# EAGLE schematic 12ChannelEMG (EAGLE 6.3)
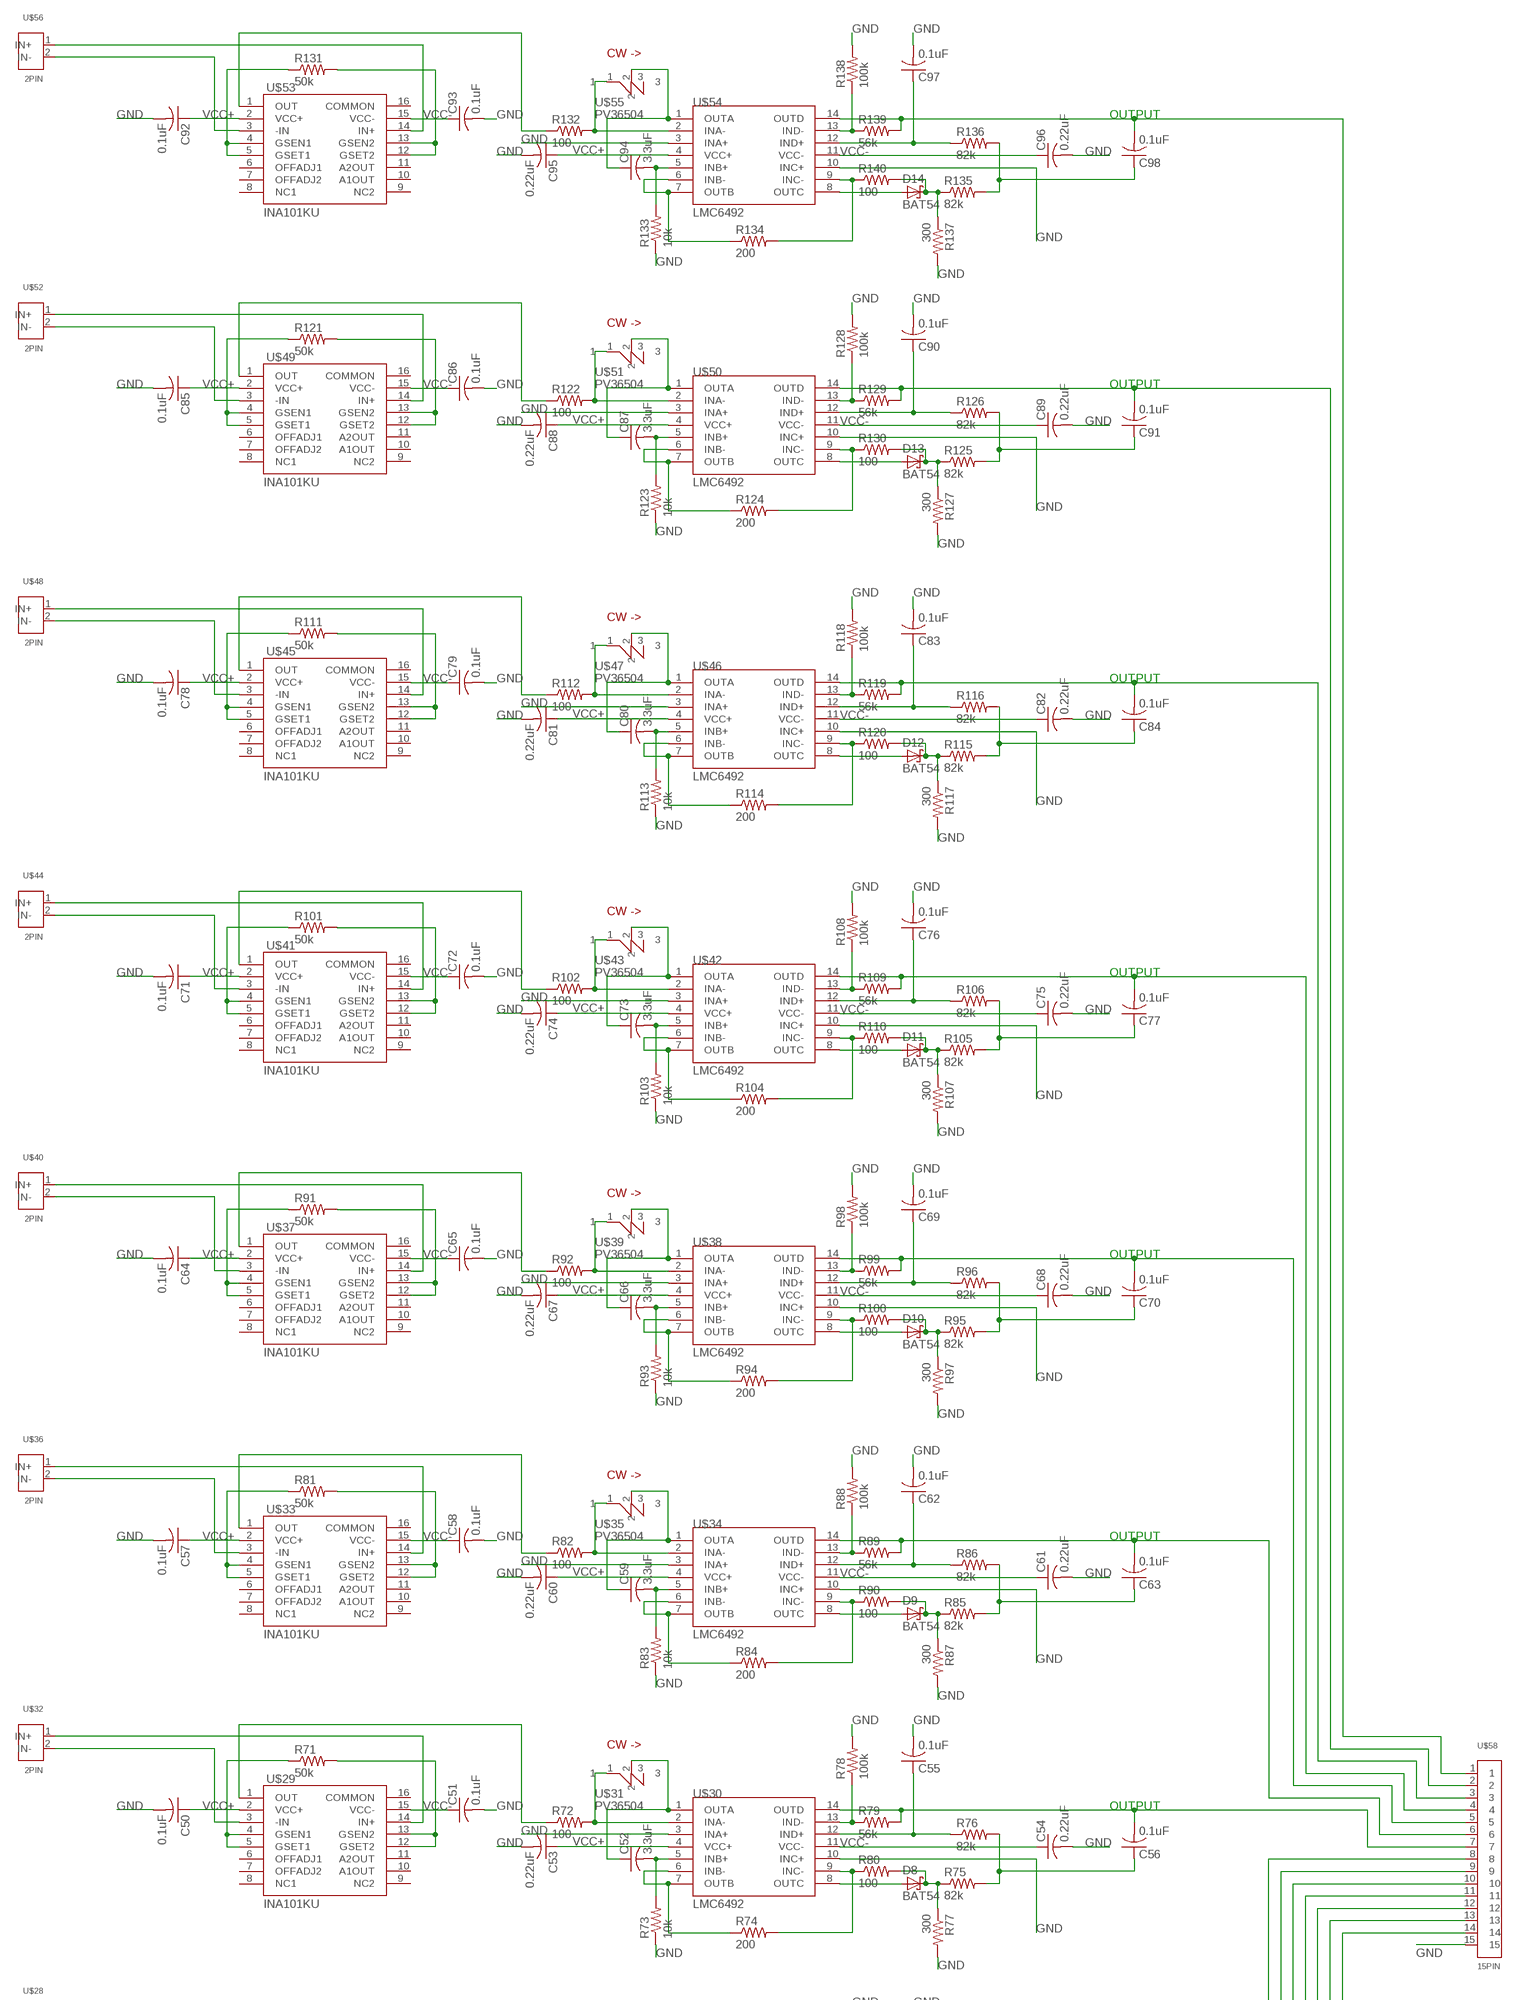
[diagram p0: schematic, sheet 1, part 1 of 2]
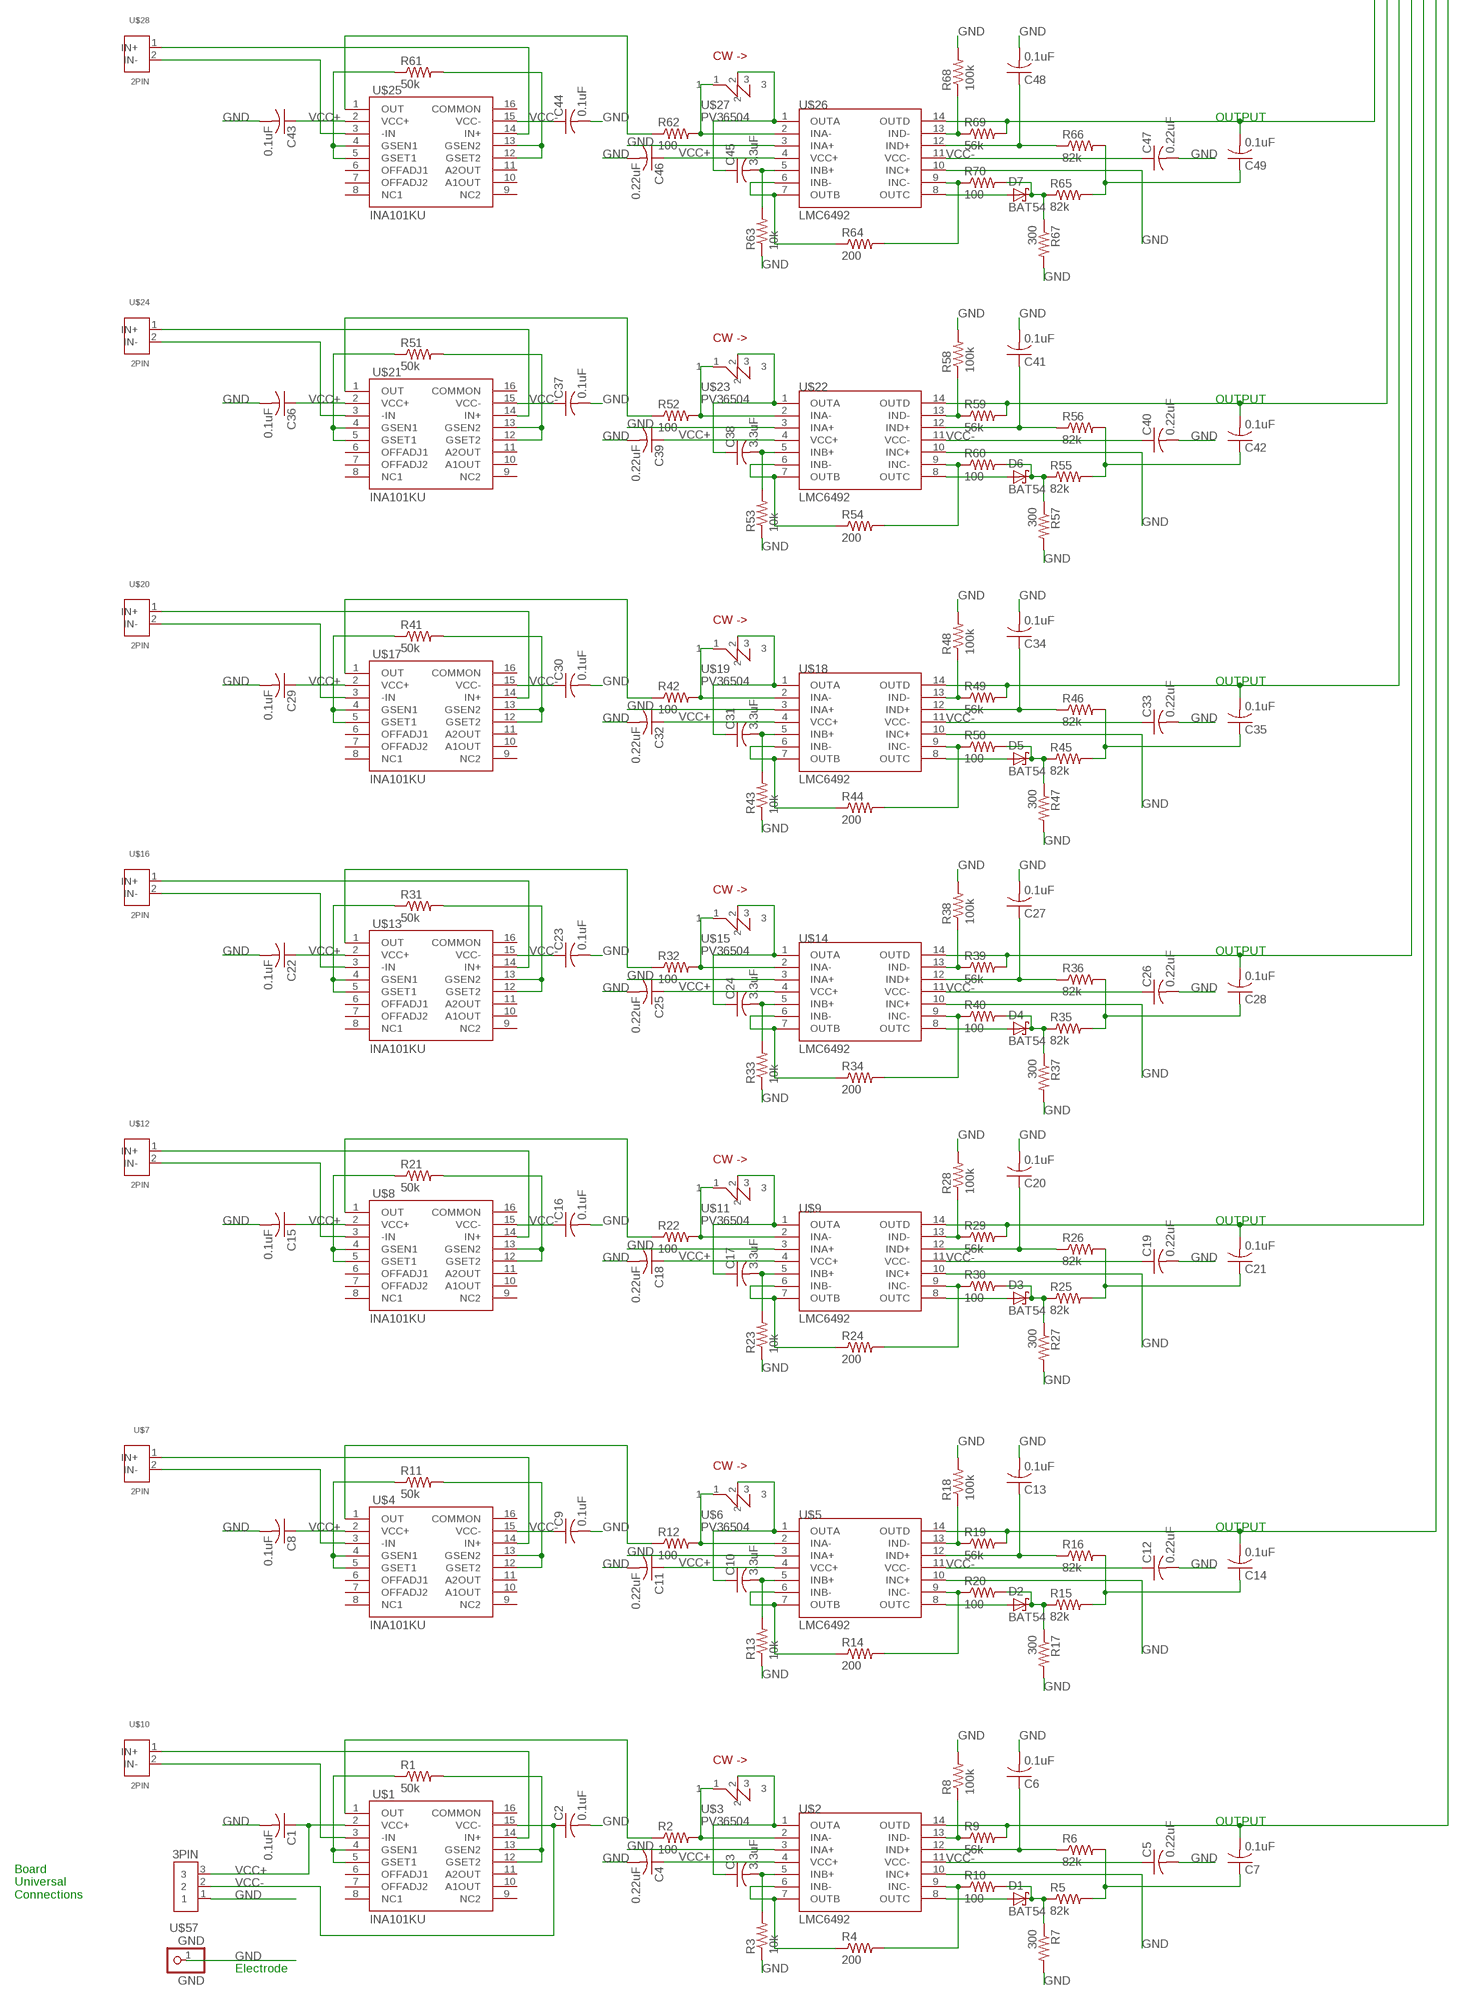
[diagram p1: schematic, sheet 1, part 2 of 2]

## Parts
C1  0.1uF  C-USC1206K  [C1206K]
C2  0.1uF  C-USC1206K  [C1206K]
C3  3.3uF  C-USC1206K  [C1206K]
C4  0.22uF  C-USC0603K  [C0603K]
C5  0.22uF  C-USC0603K  [C0603K]
C6  0.1uF  C-USC1206K  [C1206K]
C7  0.1uF  C-USC1206K  [C1206K]
C8  0.1uF  C-USC1206K  [C1206K]
C9  0.1uF  C-USC1206K  [C1206K]
C10  3.3uF  C-USC1206K  [C1206K]
C11  0.22uF  C-USC0603K  [C0603K]
C12  0.22uF  C-USC0603K  [C0603K]
C13  0.1uF  C-USC1206K  [C1206K]
C14  0.1uF  C-USC1206K  [C1206K]
C15  0.1uF  C-USC1206K  [C1206K]
C16  0.1uF  C-USC1206K  [C1206K]
C17  3.3uF  C-USC1206K  [C1206K]
C18  0.22uF  C-USC0603K  [C0603K]
C19  0.22uF  C-USC0603K  [C0603K]
C20  0.1uF  C-USC1206K  [C1206K]
C21  0.1uF  C-USC1206K  [C1206K]
C22  0.1uF  C-USC1206K  [C1206K]
C23  0.1uF  C-USC1206K  [C1206K]
C24  3.3uF  C-USC1206K  [C1206K]
C25  0.22uF  C-USC0603K  [C0603K]
C26  0.22uF  C-USC0603K  [C0603K]
C27  0.1uF  C-USC1206K  [C1206K]
C28  0.1uF  C-USC1206K  [C1206K]
C29  0.1uF  C-USC1206K  [C1206K]
C30  0.1uF  C-USC1206K  [C1206K]
C31  3.3uF  C-USC1206K  [C1206K]
C32  0.22uF  C-USC0603K  [C0603K]
C33  0.22uF  C-USC0603K  [C0603K]
C34  0.1uF  C-USC1206K  [C1206K]
C35  0.1uF  C-USC1206K  [C1206K]
C36  0.1uF  C-USC1206K  [C1206K]
C37  0.1uF  C-USC1206K  [C1206K]
C38  3.3uF  C-USC1206K  [C1206K]
C39  0.22uF  C-USC0603K  [C0603K]
C40  0.22uF  C-USC0603K  [C0603K]
C41  0.1uF  C-USC1206K  [C1206K]
C42  0.1uF  C-USC1206K  [C1206K]
C43  0.1uF  C-USC1206K  [C1206K]
C44  0.1uF  C-USC1206K  [C1206K]
C45  3.3uF  C-USC1206K  [C1206K]
C46  0.22uF  C-USC0603K  [C0603K]
C47  0.22uF  C-USC0603K  [C0603K]
C48  0.1uF  C-USC1206K  [C1206K]
C49  0.1uF  C-USC1206K  [C1206K]
C50  0.1uF  C-USC1206K  [C1206K]
C51  0.1uF  C-USC1206K  [C1206K]
C52  3.3uF  C-USC1206K  [C1206K]
C53  0.22uF  C-USC0603K  [C0603K]
C54  0.22uF  C-USC0603K  [C0603K]
C55  0.1uF  C-USC1206K  [C1206K]
C56  0.1uF  C-USC1206K  [C1206K]
C57  0.1uF  C-USC1206K  [C1206K]
C58  0.1uF  C-USC1206K  [C1206K]
C59  3.3uF  C-USC1206K  [C1206K]
C60  0.22uF  C-USC0603K  [C0603K]
C61  0.22uF  C-USC0603K  [C0603K]
C62  0.1uF  C-USC1206K  [C1206K]
C63  0.1uF  C-USC1206K  [C1206K]
C64  0.1uF  C-USC1206K  [C1206K]
C65  0.1uF  C-USC1206K  [C1206K]
C66  3.3uF  C-USC1206K  [C1206K]
C67  0.22uF  C-USC0603K  [C0603K]
C68  0.22uF  C-USC0603K  [C0603K]
C69  0.1uF  C-USC1206K  [C1206K]
C70  0.1uF  C-USC1206K  [C1206K]
C71  0.1uF  C-USC1206K  [C1206K]
C72  0.1uF  C-USC1206K  [C1206K]
C73  3.3uF  C-USC1206K  [C1206K]
C74  0.22uF  C-USC0603K  [C0603K]
C75  0.22uF  C-USC0603K  [C0603K]
C76  0.1uF  C-USC1206K  [C1206K]
C77  0.1uF  C-USC1206K  [C1206K]
C78  0.1uF  C-USC1206K  [C1206K]
C79  0.1uF  C-USC1206K  [C1206K]
C80  3.3uF  C-USC1206K  [C1206K]
C81  0.22uF  C-USC0603K  [C0603K]
C82  0.22uF  C-USC0603K  [C0603K]
C83  0.1uF  C-USC1206K  [C1206K]
C84  0.1uF  C-USC1206K  [C1206K]
C85  0.1uF  C-USC1206K  [C1206K]
C86  0.1uF  C-USC1206K  [C1206K]
C87  3.3uF  C-USC1206K  [C1206K]
C88  0.22uF  C-USC0603K  [C0603K]
C89  0.22uF  C-USC0603K  [C0603K]
C90  0.1uF  C-USC1206K  [C1206K]
C91  0.1uF  C-USC1206K  [C1206K]
C92  0.1uF  C-USC1206K  [C1206K]
C93  0.1uF  C-USC1206K  [C1206K]
C94  3.3uF  C-USC1206K  [C1206K]
C95  0.22uF  C-USC0603K  [C0603K]
C96  0.22uF  C-USC0603K  [C0603K]
C97  0.1uF  C-USC1206K  [C1206K]
C98  0.1uF  C-USC1206K  [C1206K]
D1  BAT54  [SOT23]
D2  BAT54  [SOT23]
D3  BAT54  [SOT23]
D4  BAT54  [SOT23]
D5  BAT54  [SOT23]
D6  BAT54  [SOT23]
D7  BAT54  [SOT23]
D8  BAT54  [SOT23]
D9  BAT54  [SOT23]
D10  BAT54  [SOT23]
D11  BAT54  [SOT23]
D12  BAT54  [SOT23]
D13  BAT54  [SOT23]
D14  BAT54  [SOT23]
GND  GND  PINHD-1X1  [1X01]
R1  50k  R-US_R0805  [R0805]
R2  100  R-US_R0603  [R0603]
R3  10k  R-US_R0603  [R0603]
R4  200  R-US_R0603  [R0603]
R5  82k  R-US_R0603  [R0603]
R6  82k  R-US_R0603  [R0603]
R7  300  R-US_R0603  [R0603]
R8  100k  R-US_R0603  [R0603]
R9  56k  R-US_R0603  [R0603]
R10  100  R-US_R0603  [R0603]
R11  50k  R-US_R0805  [R0805]
R12  100  R-US_R0603  [R0603]
R13  10k  R-US_R0603  [R0603]
R14  200  R-US_R0603  [R0603]
R15  82k  R-US_R0603  [R0603]
R16  82k  R-US_R0603  [R0603]
R17  300  R-US_R0603  [R0603]
R18  100k  R-US_R0603  [R0603]
R19  56k  R-US_R0603  [R0603]
R20  100  R-US_R0603  [R0603]
R21  50k  R-US_R0805  [R0805]
R22  100  R-US_R0603  [R0603]
R23  10k  R-US_R0603  [R0603]
R24  200  R-US_R0603  [R0603]
R25  82k  R-US_R0603  [R0603]
R26  82k  R-US_R0603  [R0603]
R27  300  R-US_R0603  [R0603]
R28  100k  R-US_R0603  [R0603]
R29  56k  R-US_R0603  [R0603]
R30  100  R-US_R0603  [R0603]
R31  50k  R-US_R0805  [R0805]
R32  100  R-US_R0603  [R0603]
R33  10k  R-US_R0603  [R0603]
R34  200  R-US_R0603  [R0603]
R35  82k  R-US_R0603  [R0603]
R36  82k  R-US_R0603  [R0603]
R37  300  R-US_R0603  [R0603]
R38  100k  R-US_R0603  [R0603]
R39  56k  R-US_R0603  [R0603]
R40  100  R-US_R0603  [R0603]
R41  50k  R-US_R0805  [R0805]
R42  100  R-US_R0603  [R0603]
R43  10k  R-US_R0603  [R0603]
R44  200  R-US_R0603  [R0603]
R45  82k  R-US_R0603  [R0603]
R46  82k  R-US_R0603  [R0603]
R47  300  R-US_R0603  [R0603]
R48  100k  R-US_R0603  [R0603]
R49  56k  R-US_R0603  [R0603]
R50  100  R-US_R0603  [R0603]
R51  50k  R-US_R0805  [R0805]
R52  100  R-US_R0603  [R0603]
R53  10k  R-US_R0603  [R0603]
R54  200  R-US_R0603  [R0603]
R55  82k  R-US_R0603  [R0603]
R56  82k  R-US_R0603  [R0603]
R57  300  R-US_R0603  [R0603]
R58  100k  R-US_R0603  [R0603]
R59  56k  R-US_R0603  [R0603]
R60  100  R-US_R0603  [R0603]
R61  50k  R-US_R0805  [R0805]
R62  100  R-US_R0603  [R0603]
R63  10k  R-US_R0603  [R0603]
R64  200  R-US_R0603  [R0603]
R65  82k  R-US_R0603  [R0603]
R66  82k  R-US_R0603  [R0603]
R67  300  R-US_R0603  [R0603]
R68  100k  R-US_R0603  [R0603]
R69  56k  R-US_R0603  [R0603]
R70  100  R-US_R0603  [R0603]
R71  50k  R-US_R0805  [R0805]
R72  100  R-US_R0603  [R0603]
R73  10k  R-US_R0603  [R0603]
R74  200  R-US_R0603  [R0603]
R75  82k  R-US_R0603  [R0603]
R76  82k  R-US_R0603  [R0603]
R77  300  R-US_R0603  [R0603]
R78  100k  R-US_R0603  [R0603]
R79  56k  R-US_R0603  [R0603]
R80  100  R-US_R0603  [R0603]
R81  50k  R-US_R0805  [R0805]
R82  100  R-US_R0603  [R0603]
R83  10k  R-US_R0603  [R0603]
R84  200  R-US_R0603  [R0603]
R85  82k  R-US_R0603  [R0603]
R86  82k  R-US_R0603  [R0603]
R87  300  R-US_R0603  [R0603]
R88  100k  R-US_R0603  [R0603]
R89  56k  R-US_R0603  [R0603]
R90  100  R-US_R0603  [R0603]
R91  50k  R-US_R0805  [R0805]
R92  100  R-US_R0603  [R0603]
R93  10k  R-US_R0603  [R0603]
R94  200  R-US_R0603  [R0603]
R95  82k  R-US_R0603  [R0603]
R96  82k  R-US_R0603  [R0603]
R97  300  R-US_R0603  [R0603]
R98  100k  R-US_R0603  [R0603]
R99  56k  R-US_R0603  [R0603]
R100  100  R-US_R0603  [R0603]
R101  50k  R-US_R0805  [R0805]
R102  100  R-US_R0603  [R0603]
R103  10k  R-US_R0603  [R0603]
R104  200  R-US_R0603  [R0603]
R105  82k  R-US_R0603  [R0603]
R106  82k  R-US_R0603  [R0603]
R107  300  R-US_R0603  [R0603]
R108  100k  R-US_R0603  [R0603]
R109  56k  R-US_R0603  [R0603]
R110  100  R-US_R0603  [R0603]
R111  50k  R-US_R0805  [R0805]
R112  100  R-US_R0603  [R0603]
R113  10k  R-US_R0603  [R0603]
R114  200  R-US_R0603  [R0603]
R115  82k  R-US_R0603  [R0603]
R116  82k  R-US_R0603  [R0603]
R117  300  R-US_R0603  [R0603]
R118  100k  R-US_R0603  [R0603]
R119  56k  R-US_R0603  [R0603]
R120  100  R-US_R0603  [R0603]
R121  50k  R-US_R0805  [R0805]
R122  100  R-US_R0603  [R0603]
R123  10k  R-US_R0603  [R0603]
R124  200  R-US_R0603  [R0603]
R125  82k  R-US_R0603  [R0603]
R126  82k  R-US_R0603  [R0603]
R127  300  R-US_R0603  [R0603]
R128  100k  R-US_R0603  [R0603]
R129  56k  R-US_R0603  [R0603]
R130  100  R-US_R0603  [R0603]
R131  50k  R-US_R0805  [R0805]
R132  100  R-US_R0603  [R0603]
R133  10k  R-US_R0603  [R0603]
R134  200  R-US_R0603  [R0603]
R135  82k  R-US_R0603  [R0603]
R136  82k  R-US_R0603  [R0603]
R137  300  R-US_R0603  [R0603]
R138  100k  R-US_R0603  [R0603]
R139  56k  R-US_R0603  [R0603]
R140  100  R-US_R0603  [R0603]
U$1  INA101KU  INA101KUINA101KU  [SOIC167.5MM]
U$2  LMC6492  [SOIC14]
U$3  PV36504  PV36  [PV36W]
U$4  INA101KU  INA101KUINA101KU  [SOIC167.5MM]
U$5  LMC6492  [SOIC14]
U$6  PV36504  PV36  [PV36W]
U$7  2PIN  [2PIN]
U$8  INA101KU  INA101KUINA101KU  [SOIC167.5MM]
U$9  LMC6492  [SOIC14]
U$10  2PIN  [2PIN]
U$11  PV36504  PV36  [PV36W]
U$12  2PIN  [2PIN]
U$13  INA101KU  INA101KUINA101KU  [SOIC167.5MM]
U$14  LMC6492  [SOIC14]
U$15  PV36504  PV36  [PV36W]
U$16  2PIN  [2PIN]
U$17  INA101KU  INA101KUINA101KU  [SOIC167.5MM]
U$18  LMC6492  [SOIC14]
U$19  PV36504  PV36  [PV36W]
U$20  2PIN  [2PIN]
U$21  INA101KU  INA101KUINA101KU  [SOIC167.5MM]
U$22  LMC6492  [SOIC14]
U$23  PV36504  PV36  [PV36W]
U$24  2PIN  [2PIN]
U$25  INA101KU  INA101KUINA101KU  [SOIC167.5MM]
U$26  LMC6492  [SOIC14]
U$27  PV36504  PV36  [PV36W]
U$28  2PIN  [2PIN]
U$29  INA101KU  INA101KUINA101KU  [SOIC167.5MM]
U$30  LMC6492  [SOIC14]
U$31  PV36504  PV36  [PV36W]
U$32  2PIN  [2PIN]
U$33  INA101KU  INA101KUINA101KU  [SOIC167.5MM]
U$34  LMC6492  [SOIC14]
U$35  PV36504  PV36  [PV36W]
U$36  2PIN  [2PIN]
U$37  INA101KU  INA101KUINA101KU  [SOIC167.5MM]
U$38  LMC6492  [SOIC14]
U$39  PV36504  PV36  [PV36W]
U$40  2PIN  [2PIN]
U$41  INA101KU  INA101KUINA101KU  [SOIC167.5MM]
U$42  LMC6492  [SOIC14]
U$43  PV36504  PV36  [PV36W]
U$44  2PIN  [2PIN]
U$45  INA101KU  INA101KUINA101KU  [SOIC167.5MM]
U$46  LMC6492  [SOIC14]
U$47  PV36504  PV36  [PV36W]
U$48  2PIN  [2PIN]
U$49  INA101KU  INA101KUINA101KU  [SOIC167.5MM]
U$50  LMC6492  [SOIC14]
U$51  PV36504  PV36  [PV36W]
U$52  2PIN  [2PIN]
U$53  INA101KU  INA101KUINA101KU  [SOIC167.5MM]
U$54  LMC6492  [SOIC14]
U$55  PV36504  PV36  [PV36W]
U$56  2PIN  [2PIN]
U$57  3PIN  [3PIN]
U$58  15PIN  [15PIN]

## Nets
GND: C1.2 C2.2 C4.2 C5.2 C6.2 C8.2 C9.2 C11.2 C12.2 C13.2 C15.2 C16.2 C18.2 C19.2 C20.2 C22.2 C23.2 C25.2 C26.2 C27.2 C29.2 C30.2 C32.2 C33.2 C34.2 C36.2 C37.2 C39.2 C40.2 C41.2 C43.2 C44.2 C46.2 C47.2 C48.2 C50.2 C51.2 C53.2 C54.2 C55.2 C57.2 C58.2 C60.2 C61.2 C62.2 C64.2 C65.2 C67.2 C68.2 C69.2 C71.2 C72.2 C74.2 C75.2 C76.2 C78.2 C79.2 C81.2 C82.2 C83.2 C85.2 C86.2 C88.2 C89.2 C90.2 C92.2 C93.2 C95.2 C96.2 C97.2 GND.1 R3.1 R7.2 R8.2 R13.1 R17.2 R18.2 R23.1 R27.2 R28.2 R33.1 R37.2 R38.2 R43.1 R47.2 R48.2 R53.1 R57.2 R58.2 R63.1 R67.2 R68.2 R73.1 R77.2 R78.2 R83.1 R87.2 R88.2 R93.1 R97.2 R98.2 R103.1 R107.2 R108.2 R113.1 R117.2 R118.2 R123.1 R127.2 R128.2 R133.1 R137.2 R138.2 U$2.3(INA+) U$2.10(INC+) U$5.3(INA+) U$5.10(INC+) U$9.3(INA+) U$9.10(INC+) U$14.3(INA+) U$14.10(INC+) U$18.3(INA+) U$18.10(INC+) U$22.3(INA+) U$22.10(INC+) U$26.3(INA+) U$26.10(INC+) U$30.3(INA+) U$30.10(INC+) U$34.3(INA+) U$34.10(INC+) U$38.3(INA+) U$38.10(INC+) U$42.3(INA+) U$42.10(INC+) U$46.3(INA+) U$46.10(INC+) U$50.3(INA+) U$50.10(INC+) U$54.3(INA+) U$54.10(INC+) U$57.1 U$58.15
N$1: C3.1 U$2.1(OUTA) U$3.2
N$2: R1.2 U$1.12(GSET2) U$1.13(GSEN2)
N$3: C3.2 R3.2 U$2.5(INB+)
N$4: R4.1 U$2.6(INB-) U$2.7(OUTB)
N$5: R2.2 U$2.2(INA-) U$3.1
N$6: U$1.3(-IN) U$10.2(IN-)
N$7: U$1.14(IN+) U$10.1(IN+)
N$8: R2.1 U$1.1(OUT)
N$9: R4.2 R10.1 U$2.9(INC-)
N$10: D1.1(A) U$2.8(OUTC)
N$11: C6.1 R6.1 U$2.12(IND+)
N$12: D1.3(C) R5.1 R7.1 R10.2
N$13: R11.2 U$4.12(GSET2) U$4.13(GSEN2)
N$14: C7.2 R9.2 U$2.14(OUTD) U$58.14
N$15: R8.1 R9.1 U$2.13(IND-)
N$16: C7.1 R5.2 R6.2
N$17: R1.1 U$1.4(GSEN1) U$1.5(GSET1)
N$20: U$4.3(-IN) U$7.2(IN-)
N$21: R12.2 U$5.2(INA-) U$6.1
N$22: R12.1 U$4.1(OUT)
N$23: C10.1 U$5.1(OUTA) U$6.2
N$24: C10.2 R13.2 U$5.5(INB+)
N$25: R14.1 U$5.6(INB-) U$5.7(OUTB)
N$26: R14.2 R20.1 U$5.9(INC-)
N$27: D2.1(A) U$5.8(OUTC)
N$28: C13.1 R16.1 U$5.12(IND+)
N$29: D2.3(C) R15.1 R17.1 R20.2
N$30: C14.2 R19.2 U$5.14(OUTD) U$58.13
N$31: R18.1 R19.1 U$5.13(IND-)
N$32: C14.1 R15.2 R16.2
N$33: R11.1 U$4.4(GSEN1) U$4.5(GSET1)
N$34: U$4.14(IN+) U$7.1(IN+)
N$35: R21.2 U$8.12(GSET2) U$8.13(GSEN2)
N$36: U$8.3(-IN) U$12.2(IN-)
N$37: R22.2 U$9.2(INA-) U$11.1
N$38: R22.1 U$8.1(OUT)
N$39: C17.1 U$9.1(OUTA) U$11.2
N$40: C17.2 R23.2 U$9.5(INB+)
N$41: R24.1 U$9.6(INB-) U$9.7(OUTB)
N$42: R24.2 R30.1 U$9.9(INC-)
N$43: D3.1(A) U$9.8(OUTC)
N$44: C20.1 R26.1 U$9.12(IND+)
N$45: D3.3(C) R25.1 R27.1 R30.2
N$46: C21.2 R29.2 U$9.14(OUTD) U$58.12
N$47: R28.1 R29.1 U$9.13(IND-)
N$48: C21.1 R25.2 R26.2
N$49: R21.1 U$8.4(GSEN1) U$8.5(GSET1)
N$50: U$8.14(IN+) U$12.1(IN+)
N$51: R31.2 U$13.12(GSET2) U$13.13(GSEN2)
N$52: U$13.3(-IN) U$16.2(IN-)
N$53: R32.2 U$14.2(INA-) U$15.1
N$54: R32.1 U$13.1(OUT)
N$55: C24.1 U$14.1(OUTA) U$15.2
N$56: C24.2 R33.2 U$14.5(INB+)
N$57: R34.1 U$14.6(INB-) U$14.7(OUTB)
N$58: R34.2 R40.1 U$14.9(INC-)
N$59: D4.1(A) U$14.8(OUTC)
N$60: C27.1 R36.1 U$14.12(IND+)
N$61: D4.3(C) R35.1 R37.1 R40.2
N$62: C28.2 R39.2 U$14.14(OUTD) U$58.11
N$63: R38.1 R39.1 U$14.13(IND-)
N$64: C28.1 R35.2 R36.2
N$65: R31.1 U$13.4(GSEN1) U$13.5(GSET1)
N$66: U$13.14(IN+) U$16.1(IN+)
N$67: R41.2 U$17.12(GSET2) U$17.13(GSEN2)
N$68: U$17.3(-IN) U$20.2(IN-)
N$69: R42.2 U$18.2(INA-) U$19.1
N$70: R42.1 U$17.1(OUT)
N$71: C31.1 U$18.1(OUTA) U$19.2
N$72: C31.2 R43.2 U$18.5(INB+)
N$73: R44.1 U$18.6(INB-) U$18.7(OUTB)
N$74: R44.2 R50.1 U$18.9(INC-)
N$75: D5.1(A) U$18.8(OUTC)
N$76: C34.1 R46.1 U$18.12(IND+)
N$77: D5.3(C) R45.1 R47.1 R50.2
N$78: C35.2 R49.2 U$18.14(OUTD) U$58.10
N$79: R48.1 R49.1 U$18.13(IND-)
N$80: C35.1 R45.2 R46.2
N$81: R41.1 U$17.4(GSEN1) U$17.5(GSET1)
N$82: U$17.14(IN+) U$20.1(IN+)
N$83: R51.2 U$21.12(GSET2) U$21.13(GSEN2)
N$84: U$21.3(-IN) U$24.2(IN-)
N$85: R52.2 U$22.2(INA-) U$23.1
N$86: R52.1 U$21.1(OUT)
N$87: C38.1 U$22.1(OUTA) U$23.2
N$88: C38.2 R53.2 U$22.5(INB+)
N$89: R54.1 U$22.6(INB-) U$22.7(OUTB)
N$90: R54.2 R60.1 U$22.9(INC-)
N$91: D6.1(A) U$22.8(OUTC)
N$92: C41.1 R56.1 U$22.12(IND+)
N$93: D6.3(C) R55.1 R57.1 R60.2
N$94: C42.2 R59.2 U$22.14(OUTD) U$58.9
N$95: R58.1 R59.1 U$22.13(IND-)
N$96: C42.1 R55.2 R56.2
N$97: R51.1 U$21.4(GSEN1) U$21.5(GSET1)
N$98: U$21.14(IN+) U$24.1(IN+)
N$99: R61.2 U$25.12(GSET2) U$25.13(GSEN2)
N$100: U$25.3(-IN) U$28.2(IN-)
N$101: R62.2 U$26.2(INA-) U$27.1
N$102: R62.1 U$25.1(OUT)
N$103: C45.1 U$26.1(OUTA) U$27.2
N$104: C45.2 R63.2 U$26.5(INB+)
N$105: R64.1 U$26.6(INB-) U$26.7(OUTB)
N$106: R64.2 R70.1 U$26.9(INC-)
N$107: D7.1(A) U$26.8(OUTC)
N$108: C48.1 R66.1 U$26.12(IND+)
N$109: D7.3(C) R65.1 R67.1 R70.2
N$110: C49.2 R69.2 U$26.14(OUTD) U$58.8
N$111: R68.1 R69.1 U$26.13(IND-)
N$112: C49.1 R65.2 R66.2
N$113: R61.1 U$25.4(GSEN1) U$25.5(GSET1)
N$114: U$25.14(IN+) U$28.1(IN+)
N$115: R71.2 U$29.12(GSET2) U$29.13(GSEN2)
N$116: U$29.3(-IN) U$32.2(IN-)
N$117: R72.2 U$30.2(INA-) U$31.1
N$118: R72.1 U$29.1(OUT)
N$119: C52.1 U$30.1(OUTA) U$31.2
N$120: C52.2 R73.2 U$30.5(INB+)
N$121: R74.1 U$30.6(INB-) U$30.7(OUTB)
N$122: R74.2 R80.1 U$30.9(INC-)
N$123: D8.1(A) U$30.8(OUTC)
N$124: C55.1 R76.1 U$30.12(IND+)
N$125: D8.3(C) R75.1 R77.1 R80.2
N$126: C56.2 R79.2 U$30.14(OUTD) U$58.7
N$127: R78.1 R79.1 U$30.13(IND-)
N$128: C56.1 R75.2 R76.2
N$129: R71.1 U$29.4(GSEN1) U$29.5(GSET1)
N$130: U$29.14(IN+) U$32.1(IN+)
N$131: R81.2 U$33.12(GSET2) U$33.13(GSEN2)
N$132: U$33.3(-IN) U$36.2(IN-)
N$133: R82.2 U$34.2(INA-) U$35.1
N$134: R82.1 U$33.1(OUT)
N$135: C59.1 U$34.1(OUTA) U$35.2
N$136: C59.2 R83.2 U$34.5(INB+)
N$137: R84.1 U$34.6(INB-) U$34.7(OUTB)
N$138: R84.2 R90.1 U$34.9(INC-)
N$139: D9.1(A) U$34.8(OUTC)
N$140: C62.1 R86.1 U$34.12(IND+)
N$141: D9.3(C) R85.1 R87.1 R90.2
N$142: C63.2 R89.2 U$34.14(OUTD) U$58.6
N$143: R88.1 R89.1 U$34.13(IND-)
N$144: C63.1 R85.2 R86.2
N$145: R81.1 U$33.4(GSEN1) U$33.5(GSET1)
N$146: U$33.14(IN+) U$36.1(IN+)
N$147: R91.2 U$37.12(GSET2) U$37.13(GSEN2)
N$148: U$37.3(-IN) U$40.2(IN-)
N$149: R92.2 U$38.2(INA-) U$39.1
N$150: R92.1 U$37.1(OUT)
N$151: C66.1 U$38.1(OUTA) U$39.2
N$152: C66.2 R93.2 U$38.5(INB+)
N$153: R94.1 U$38.6(INB-) U$38.7(OUTB)
N$154: R94.2 R100.1 U$38.9(INC-)
N$155: D10.1(A) U$38.8(OUTC)
N$156: C69.1 R96.1 U$38.12(IND+)
N$157: D10.3(C) R95.1 R97.1 R100.2
N$158: C70.2 R99.2 U$38.14(OUTD) U$58.5
N$159: R98.1 R99.1 U$38.13(IND-)
N$160: C70.1 R95.2 R96.2
N$161: R91.1 U$37.4(GSEN1) U$37.5(GSET1)
N$162: U$37.14(IN+) U$40.1(IN+)
N$163: R101.2 U$41.12(GSET2) U$41.13(GSEN2)
N$164: U$41.3(-IN) U$44.2(IN-)
N$165: R102.2 U$42.2(INA-) U$43.1
N$166: R102.1 U$41.1(OUT)
N$167: C73.1 U$42.1(OUTA) U$43.2
N$168: C73.2 R103.2 U$42.5(INB+)
N$169: R104.1 U$42.6(INB-) U$42.7(OUTB)
N$170: R104.2 R110.1 U$42.9(INC-)
N$171: D11.1(A) U$42.8(OUTC)
N$172: C76.1 R106.1 U$42.12(IND+)
N$173: D11.3(C) R105.1 R107.1 R110.2
N$174: C77.2 R109.2 U$42.14(OUTD) U$58.4
N$175: R108.1 R109.1 U$42.13(IND-)
N$176: C77.1 R105.2 R106.2
N$177: R101.1 U$41.4(GSEN1) U$41.5(GSET1)
N$178: U$41.14(IN+) U$44.1(IN+)
N$179: R111.2 U$45.12(GSET2) U$45.13(GSEN2)
N$180: U$45.3(-IN) U$48.2(IN-)
N$181: R112.2 U$46.2(INA-) U$47.1
N$182: R112.1 U$45.1(OUT)
N$183: C80.1 U$46.1(OUTA) U$47.2
N$184: C80.2 R113.2 U$46.5(INB+)
N$185: R114.1 U$46.6(INB-) U$46.7(OUTB)
N$186: R114.2 R120.1 U$46.9(INC-)
N$187: D12.1(A) U$46.8(OUTC)
N$188: C83.1 R116.1 U$46.12(IND+)
N$189: D12.3(C) R115.1 R117.1 R120.2
N$190: C84.2 R119.2 U$46.14(OUTD) U$58.3
N$191: R118.1 R119.1 U$46.13(IND-)
N$192: C84.1 R115.2 R116.2
N$193: R111.1 U$45.4(GSEN1) U$45.5(GSET1)
N$194: U$45.14(IN+) U$48.1(IN+)
N$195: R121.2 U$49.12(GSET2) U$49.13(GSEN2)
N$196: U$49.3(-IN) U$52.2(IN-)
N$197: R122.2 U$50.2(INA-) U$51.1
N$198: R122.1 U$49.1(OUT)
N$199: C87.1 U$50.1(OUTA) U$51.2
N$200: C87.2 R123.2 U$50.5(INB+)
N$201: R124.1 U$50.6(INB-) U$50.7(OUTB)
N$202: R124.2 R130.1 U$50.9(INC-)
N$203: D13.1(A) U$50.8(OUTC)
N$204: C90.1 R126.1 U$50.12(IND+)
N$205: D13.3(C) R125.1 R127.1 R130.2
N$206: C91.2 R129.2 U$50.14(OUTD) U$58.2
N$207: R128.1 R129.1 U$50.13(IND-)
N$208: C91.1 R125.2 R126.2
N$209: R121.1 U$49.4(GSEN1) U$49.5(GSET1)
N$210: U$49.14(IN+) U$52.1(IN+)
N$211: R131.2 U$53.12(GSET2) U$53.13(GSEN2)
N$212: U$53.3(-IN) U$56.2(IN-)
N$213: R132.2 U$54.2(INA-) U$55.1
N$214: R132.1 U$53.1(OUT)
N$215: C94.1 U$54.1(OUTA) U$55.2
N$216: C94.2 R133.2 U$54.5(INB+)
N$217: R134.1 U$54.6(INB-) U$54.7(OUTB)
N$218: R134.2 R140.1 U$54.9(INC-)
N$219: D14.1(A) U$54.8(OUTC)
N$220: C97.1 R136.1 U$54.12(IND+)
N$221: D14.3(C) R135.1 R137.1 R140.2
N$222: C98.2 R139.2 U$54.14(OUTD) U$58.1
N$223: R138.1 R139.1 U$54.13(IND-)
N$224: C98.1 R135.2 R136.2
N$225: R131.1 U$53.4(GSEN1) U$53.5(GSET1)
N$226: U$53.14(IN+) U$56.1(IN+)
VCC+: C1.1 C4.1 C8.1 C11.1 C15.1 C18.1 C22.1 C25.1 C29.1 C32.1 C36.1 C39.1 C43.1 C46.1 C50.1 C53.1 C57.1 C60.1 C64.1 C67.1 C71.1 C74.1 C78.1 C81.1 C85.1 C88.1 C92.1 C95.1 U$1.2(VCC+) U$2.4(VCC+) U$4.2(VCC+) U$5.4(VCC+) U$8.2(VCC+) U$9.4(VCC+) U$13.2(VCC+) U$14.4(VCC+) U$17.2(VCC+) U$18.4(VCC+) U$21.2(VCC+) U$22.4(VCC+) U$25.2(VCC+) U$26.4(VCC+) U$29.2(VCC+) U$30.4(VCC+) U$33.2(VCC+) U$34.4(VCC+) U$37.2(VCC+) U$38.4(VCC+) U$41.2(VCC+) U$42.4(VCC+) U$45.2(VCC+) U$46.4(VCC+) U$49.2(VCC+) U$50.4(VCC+) U$53.2(VCC+) U$54.4(VCC+) U$57.3
VCC-: C2.1 C5.1 C9.1 C12.1 C16.1 C19.1 C23.1 C26.1 C30.1 C33.1 C37.1 C40.1 C44.1 C47.1 C51.1 C54.1 C58.1 C61.1 C65.1 C68.1 C72.1 C75.1 C79.1 C82.1 C86.1 C89.1 C93.1 C96.1 U$1.15(VCC-) U$2.11(VCC-) U$4.15(VCC-) U$5.11(VCC-) U$8.15(VCC-) U$9.11(VCC-) U$13.15(VCC-) U$14.11(VCC-) U$17.15(VCC-) U$18.11(VCC-) U$21.15(VCC-) U$22.11(VCC-) U$25.15(VCC-) U$26.11(VCC-) U$29.15(VCC-) U$30.11(VCC-) U$33.15(VCC-) U$34.11(VCC-) U$37.15(VCC-) U$38.11(VCC-) U$41.15(VCC-) U$42.11(VCC-) U$45.15(VCC-) U$46.11(VCC-) U$49.15(VCC-) U$50.11(VCC-) U$53.15(VCC-) U$54.11(VCC-) U$57.2
Unconnected: U$1.6(OFFADJ1) U$1.7(OFFADJ2) U$1.8(NC1) U$1.9(NC2) U$1.10(A1OUT) U$1.11(A2OUT) U$1.16(COMMON) U$3.3 U$4.6(OFFADJ1) U$4.7(OFFADJ2) U$4.8(NC1) U$4.9(NC2) U$4.10(A1OUT) U$4.11(A2OUT) U$4.16(COMMON) U$6.3 U$8.6(OFFADJ1) U$8.7(OFFADJ2) U$8.8(NC1) U$8.9(NC2) U$8.10(A1OUT) U$8.11(A2OUT) U$8.16(COMMON) U$11.3 U$13.6(OFFADJ1) U$13.7(OFFADJ2) U$13.8(NC1) U$13.9(NC2) U$13.10(A1OUT) U$13.11(A2OUT) U$13.16(COMMON) U$15.3 U$17.6(OFFADJ1) U$17.7(OFFADJ2) U$17.8(NC1) U$17.9(NC2) U$17.10(A1OUT) U$17.11(A2OUT) U$17.16(COMMON) U$19.3 U$21.6(OFFADJ1) U$21.7(OFFADJ2) U$21.8(NC1) U$21.9(NC2) U$21.10(A1OUT) U$21.11(A2OUT) U$21.16(COMMON) U$23.3 U$25.6(OFFADJ1) U$25.7(OFFADJ2) U$25.8(NC1) U$25.9(NC2) U$25.10(A1OUT) U$25.11(A2OUT) U$25.16(COMMON) U$27.3 U$29.6(OFFADJ1) U$29.7(OFFADJ2) U$29.8(NC1) U$29.9(NC2) U$29.10(A1OUT) U$29.11(A2OUT) U$29.16(COMMON) U$31.3 U$33.6(OFFADJ1) U$33.7(OFFADJ2) U$33.8(NC1) U$33.9(NC2) U$33.10(A1OUT) U$33.11(A2OUT) U$33.16(COMMON) U$35.3 U$37.6(OFFADJ1) U$37.7(OFFADJ2) U$37.8(NC1) U$37.9(NC2) U$37.10(A1OUT) U$37.11(A2OUT) U$37.16(COMMON) U$39.3 U$41.6(OFFADJ1) U$41.7(OFFADJ2) U$41.8(NC1) U$41.9(NC2) U$41.10(A1OUT) U$41.11(A2OUT) U$41.16(COMMON) U$43.3 U$45.6(OFFADJ1) U$45.7(OFFADJ2) U$45.8(NC1) U$45.9(NC2) U$45.10(A1OUT) U$45.11(A2OUT) U$45.16(COMMON) U$47.3 U$49.6(OFFADJ1) U$49.7(OFFADJ2) U$49.8(NC1) U$49.9(NC2) U$49.10(A1OUT) U$49.11(A2OUT) U$49.16(COMMON) U$51.3 U$53.6(OFFADJ1) U$53.7(OFFADJ2) U$53.8(NC1) U$53.9(NC2) U$53.10(A1OUT) U$53.11(A2OUT) U$53.16(COMMON) U$55.3

## Notes on the sheet
- OUTPUT
- OUTPUT
- OUTPUT
- OUTPUT
- OUTPUT
- OUTPUT
- OUTPUT
- OUTPUT
- OUTPUT
- OUTPUT
- OUTPUT
- OUTPUT
- OUTPUT
- OUTPUT
- Board
  Universal
  Connections
- Electrode

## Library data of the parts
C1-C3 C6-C10 C13-C17 C20-C24 C27-C31 C34-C38 C41-C45 C48-C52 C55-C59 C62-C66 C69-C73 C76-C80 C83-C87 C90-C94 C97 C98 = resistor:C-US: CAPACITOR, American symbol
C4 C5 C11 C12 C18 C19 C25 C26 C32 C33 C39 C40 C46 C47 C53 C54 C60 C61 C67 C68 C74 C75 C81 C82 C88 C89 C95 C96 = rcl:C-US: CAPACITOR, American symbol
D1-D14 = diode:BAT54: Schottky Diodes Source: Fairchild .. BAT54.pdf
GND = pinhead:PINHD-1X1: PIN HEADER
R1 R3 R4 R11 R13 R14 R21 R23 R24 R31 R33 R34 R41 R43 R44 R51 R53 R54 R61 R63 R64 R71 R73 R74 R81 R83 R84 R91 R93 R94 R101 R103 R104 R111 R113 R114 R121 R123 R124 R131 R133 R134 = rcl:R-US_: RESISTOR, American symbol
R2 R5-R10 R12 R15-R20 R22 R25-R30 R32 R35-R40 R42 R45-R50 R52 R55-R60 R62 R65-R70 R72 R75-R80 R82 R85-R90 R92 R95-R100 R102 R105-R110 R112 R115-R120 R122 R125-R130 R132 R135-R140 = resistor:R-US_: RESISTOR, American symbol
U$1 U$4 U$8 U$13 U$17 U$21 U$25 U$29 U$33 U$37 U$41 U$45 U$49 U$53 = 12-ChannelEMG:INA101KU
U$2 U$5 U$9 U$14 U$18 U$22 U$26 U$30 U$34 U$38 U$42 U$46 U$50 U$54 = 12-ChannelEMG:LMC6492
U$3 U$6 U$11 U$15 U$19 U$23 U$27 U$31 U$35 U$39 U$43 U$47 U$51 U$55 = 12-ChannelEMG:PV36
U$7 U$10 U$12 U$16 U$20 U$24 U$28 U$32 U$36 U$40 U$44 U$48 U$52 U$56 = 12-ChannelEMG:2PIN
U$57 = 12-ChannelEMG:3PIN
U$58 = 12-ChannelEMG:15PIN